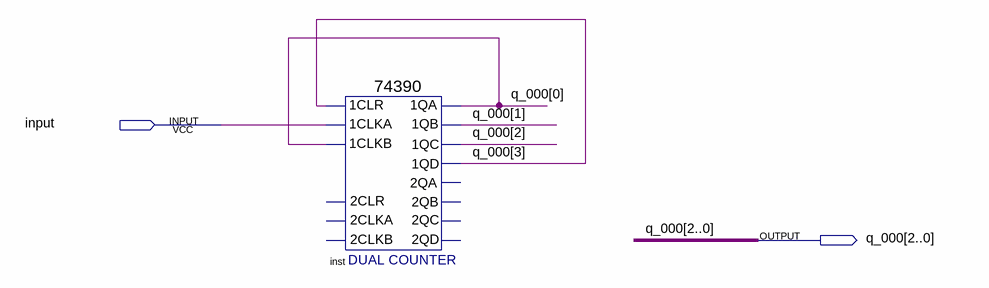
[diagram p0: schematic sheet]
// Quartus schematic cnt8.bdf as structural Verilog: 1 symbols, 2 pins
module cnt8 (
  input  \input ,
  output [3:0] q_000
);

  \74390  inst (
    .\1CLR (q_000[3]), .\1CLKA (\input ), .\1CLKB (q_000[0]), .\1QA (q_000[0]), .\1QB (q_000[1]),
    .\1QC (q_000[2]), .\1QD (q_000[3]));  // open: 2CLKA, 2CLR, 2CLKB, 2QA, 2QB, 2QC, 2QD
endmodule
